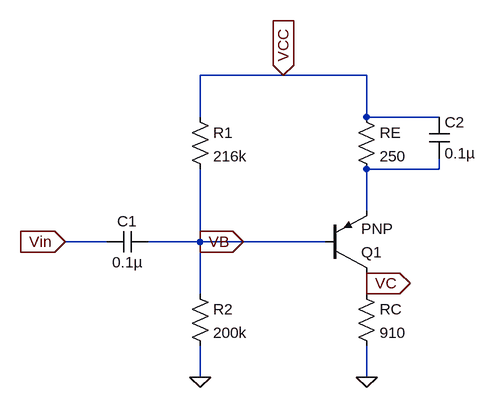
[diagram p0: schematic CE_pnp.asc]
CE_pnp.asc, the LTspice schematic file:
Version 4
SHEET 1 908 680
WIRE 608 96 480 96
WIRE 736 96 608 96
WIRE 480 160 480 96
WIRE 736 160 736 96
WIRE 848 160 736 160
WIRE 848 240 848 224
WIRE 848 240 736 240
WIRE 736 304 736 240
WIRE 336 352 272 352
WIRE 480 352 480 240
WIRE 480 352 400 352
WIRE 672 352 480 352
WIRE 736 416 736 400
WIRE 480 432 480 352
WIRE 736 432 736 416
WIRE 480 560 480 512
WIRE 736 560 736 512
FLAG 480 560 0
FLAG 736 560 0
FLAG 608 96 VCC
IOPIN 608 96 In
FLAG 272 352 Vin
IOPIN 272 352 In
FLAG 480 352 VB
IOPIN 480 352 Out
FLAG 736 416 VC
IOPIN 736 416 Out
SYMBOL Res 464 144 R0
SYMATTR InstName R1
SYMATTR Value 216k
SYMBOL Res 464 416 R0
SYMATTR InstName R2
SYMATTR Value 200k
SYMBOL Res 720 144 R0
SYMATTR InstName RE
SYMATTR Value 250
SYMBOL Cap 400 336 R90
WINDOW 0 0 32 VBottom 2
WINDOW 3 32 32 VTop 2
SYMATTR InstName C1
SYMATTR Value 0.1µ
SYMBOL pnp 672 400 M180
SYMATTR InstName Q1
SYMBOL Res 720 416 R0
SYMATTR InstName RC
SYMATTR Value 910
SYMBOL Cap 832 160 R0
SYMATTR InstName C2
SYMATTR Value 0.1µ

The netlist it stands for:
* CE_pnp.asc
R1 VCC VB 216k
R2 VB 0 200k
RE VCC N001 250
C1 VB Vin 0.1µ
Q1 VC VB N001 0 PNP
RC VC 0 910
C2 VCC N001 0.1µ
.model NPN NPN
.model PNP PNP
.lib standard.bjt
.backanno
.end